# EAGLE design lisa_l_low_carrier (EAGLE 6.1)
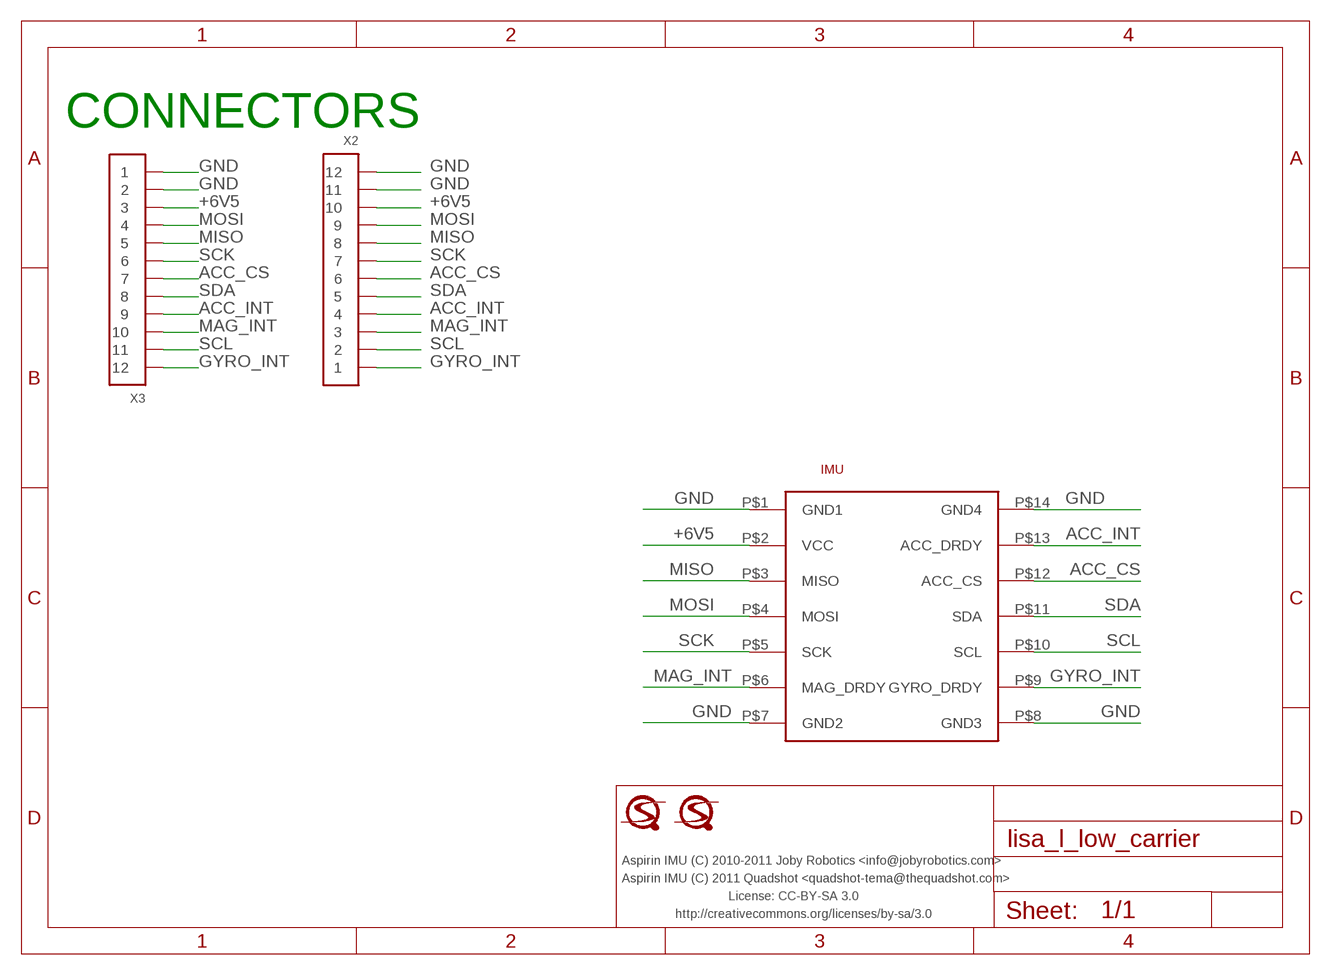
[diagram p0: schematic, sheet 1]

## Parts
IMU  ASPIRIN  [ASPIRIN_1]
U$1  LOGO  [LOGO]
U$2  LOGO  [LOGO]
X2  CONN_12-1-53261  [PB-53261-12]
X3  CONN_12-1-53047  [PB-53047-12]

## Nets
+6V5: IMU.P$2(VCC) X2.10 X3.3
ACC_CS: IMU.P$12(ACC_CS) X2.6 X3.7
ACC_INT: IMU.P$13(ACC_DRDY) X2.4 X3.9
GND: IMU.P$1(GND1) IMU.P$7(GND2) IMU.P$8(GND3) IMU.P$14(GND4) X2.11 X2.12 X3.1 X3.2
GYRO_INT: IMU.P$9(GYRO_DRDY) X2.1 X3.12
MAG_INT: IMU.P$6(MAG_DRDY) X2.3 X3.10
MISO: IMU.P$3(MISO) X2.8 X3.5
MOSI: IMU.P$4(MOSI) X2.9 X3.4
SCK: IMU.P$5(SCK) X2.7 X3.6
SCL: IMU.P$10(SCL) X2.2 X3.11
SDA: IMU.P$11(SDA) X2.5 X3.8

## Notes on the sheet
- CONNECTORS
- Aspirin IMU (C) 2010-2011 Joby Robotics <info@jobyrobotics.com>
- Aspirin IMU (C) 2011 Quadshot <quadshot-tema@thequadshot.com>
- License: CC-BY-SA 3.0
- http://creativecommons.org/licenses/by-sa/3.0

## Library data of the parts
IMU = joby_robotics:ASPIRIN
U$1 U$2 = quadshot:LOGO
X2 X3 = pel_molex:CONN_12-1

## Board
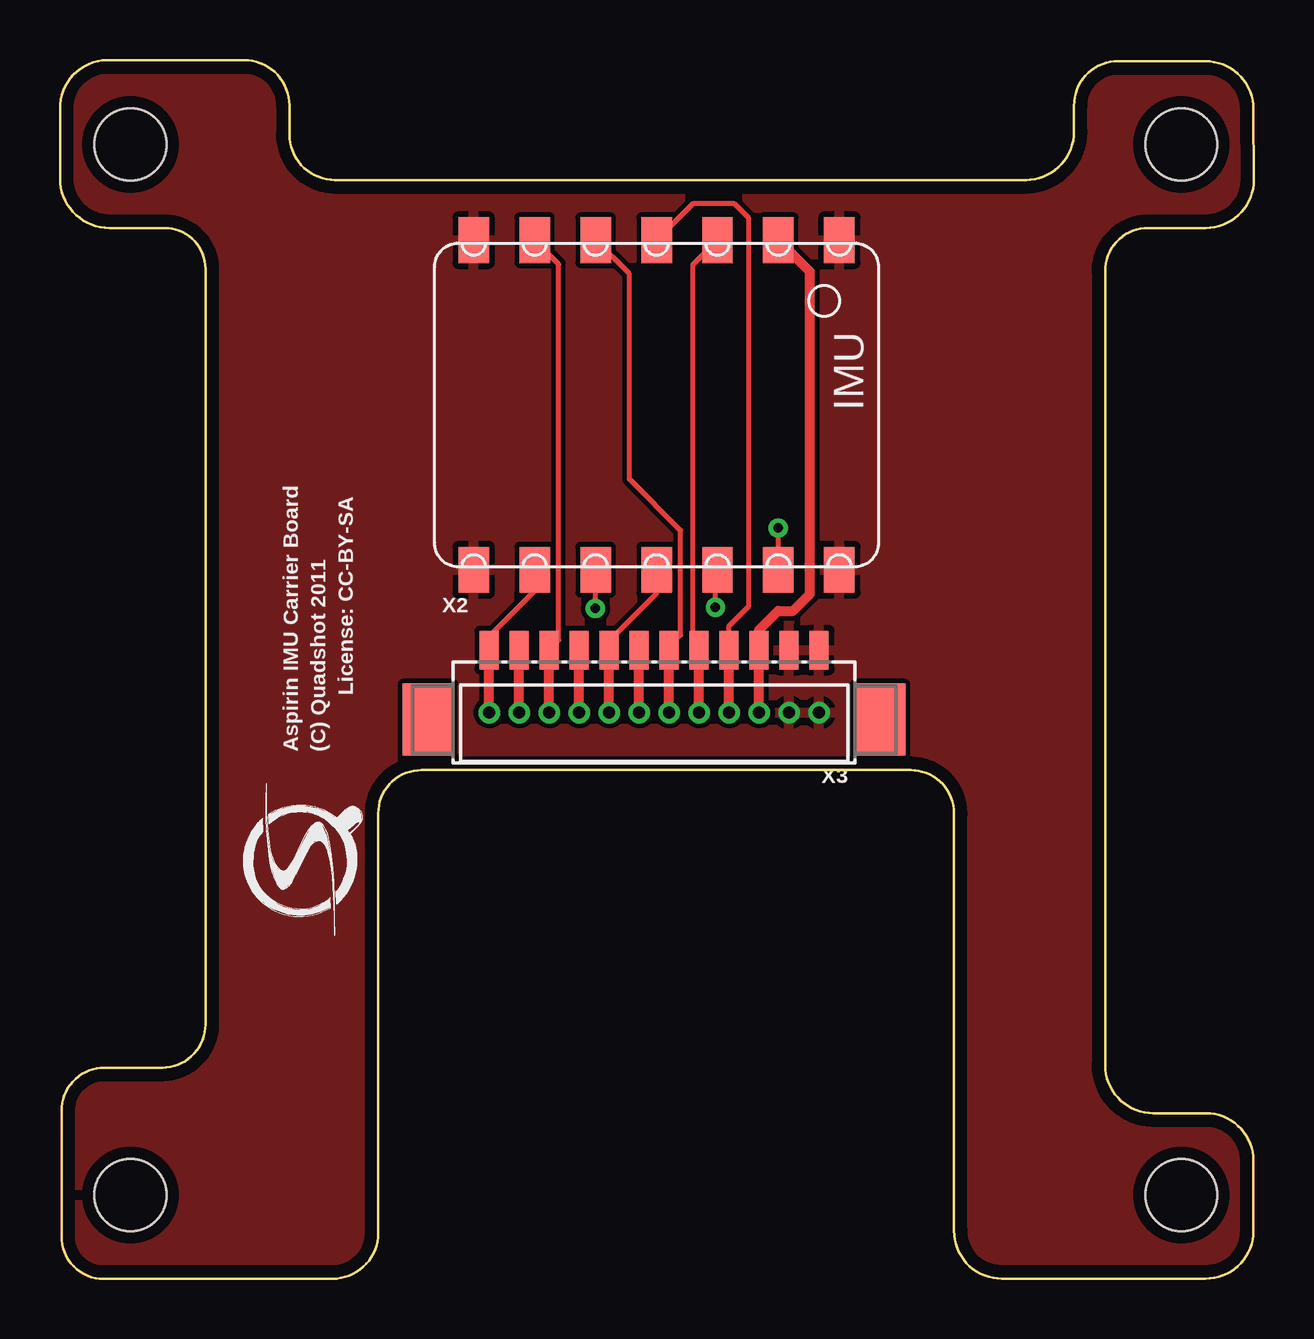
[diagram p1: board, top side]
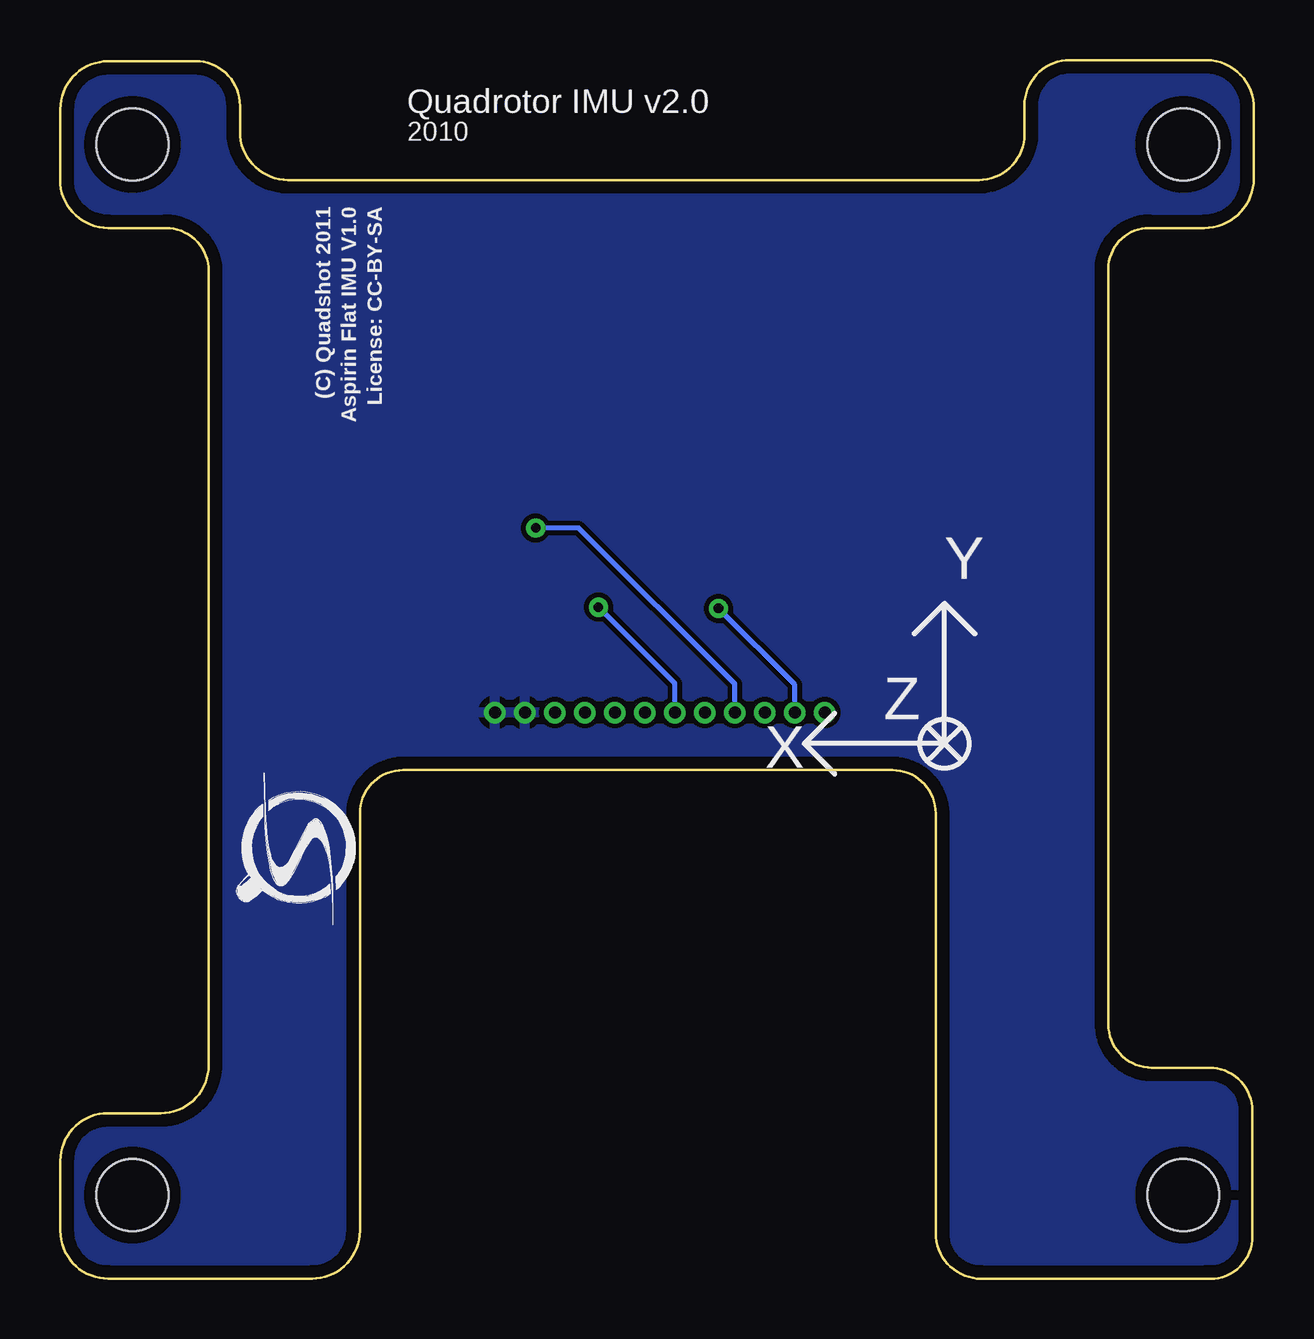
[diagram p2: board, bottom side, seen from below]

Size 49.76 x 50.81 mm. Coordinates in mm from the lower left corner, seen from the top.
Outline: 1.96,50.81 7.66,50.81 arc-90 9.56,48.91 9.56,47.71 arc90 11.46,45.81 40.26,45.81 arc90 42.26,47.81 42.26,48.91 arc-90 44.11,50.76 47.75,50.76 arc-90 49.75,48.76 49.76,45.81 arc-90 47.76,43.81 45.36,43.81 arc90 43.56,42.01 43.56,8.91 arc90 45.56,6.91 47.76,6.91 arc-90 49.75,4.92 49.75,2.01 arc-90 47.75,0.01 39.26,0.01 arc-90 37.26,2.01 37.26,19.41 arc90 35.46,21.21 15.06,21.21 arc90 13.26,19.41 13.26,1.91 arc-90 11.36,0.01 2,0.01 arc-90 0.06,1.61 0.06,7.01 arc-90 1.86,8.81 4.26,8.81 arc90 6.06,10.61 6.06,42.11 arc90 4.36,43.81 2.06,43.81 arc-90 0,45.87 0,48.76 arc-90 1.96,50.81
Copper layers (1*16): Top 0.035mm / dielectric 0.2mm / Bottom 0.035mm
Design rules: minimum track width 8mil, minimum drill 0.4mm, track to track 8mil, track to pad 8mil, pad to pad 8mil, via to via 8mil, smd to smd 8mil, copper to edge 20mil, drill to drill 8mil, minimum pad ring 0.2mm, minimum via ring 0.2mm, stop-mask expansion 4mil, vias tented up to drill 0.4mm, thermal gap 10mil
Holes 3 mm at 46.74,3.49 2.94,3.49 46.74,47.29 2.94,47.29

### Footprints (pad centres in the part's own frame; a part is rotated, then mirrored left to right if it is on the bottom)
ASPIRIN_1 = smd 1.905 x 1.27: P$1 -6.87,7.62; P$2 -6.87,5.08; P$3 -6.87,2.54; P$4 -6.87,0; P$5 -6.87,-2.54; P$6 -6.87,-5.08; P$7 -6.87,-7.62; P$8 6.87,-7.62; P$9 6.87,-5.08; P$10 6.87,-2.54; P$11 6.87,0; P$12 6.87,2.54; P$13 6.87,5.08; P$14 6.87,7.62
PB-53261-12 = smd 0.8 x 1.6: 1 -6.875,1.1; 2 -5.625,1.1; 3 -4.375,1.1; 4 -3.125,1.1; 5 -1.875,1.1; 6 -0.625,1.1; 7 0.625,1.1; 8 1.875,1.1; 9 3.125,1.1; 10 4.375,1.1; 11 5.625,1.1; 12 6.875,1.1 | smd 2.1 x 3: MNT1 -9.425,-1.8; MNT2 9.425,-1.8
PB-53047-12 = drill 0.5: 1 -6.875,0; 2 -5.625,0; 3 -4.375,0; 4 -3.125,0; 5 -1.875,0; 6 -0.625,0; 7 0.625,0; 8 1.875,0; 9 3.125,0; 10 4.375,0; 11 5.625,0; 12 6.875,0

### Placement (x,y rotation side)
IMU  24.87,36.43 270 top
U$1  39.76,17.91 270 bottom
U$2  9.96,17.51 90 top
X2  24.76,25.11 0 top
X3  24.76,23.61 180 top

### Tracks (layer width: path | path; a pad name or v marks a point on that pad's centre or on a via)
+6V5
  Top 0.406: X3.3 X2.10 29.14,27.05 29.93,27.85 30.54,27.85 31.25,28.56 31.25,41.99 IMU.P$2
ACC_CS  (via drill 0.4)
  Top 0.203: IMU.P$12 27.32,29.47 v27.32,28
  Top 0.406: X3.7 X2.6
  Bottom 0.203: v27.32,28 24.14,24.82 X3.7
ACC_INT  (via drill 0.4)
  Top 0.203: IMU.P$13 29.93,29.57 v29.93,31.3
  Top 0.406: X3.9 X2.4
  Bottom 0.203: v29.93,31.3 28.14,31.3 21.64,24.8 X3.9
GND
  pour Top (rank 6): 0,0.03 49.71,0.03 49.71,50.76 0,50.76
  pour Bottom: 0.08,50.76 49.71,50.76 49.71,0.08 0.08,0.08
GYRO_INT
  Top 0.203: IMU.P$9 19.79,28.67 17.89,26.77 X2.1
  Top 0.406: X3.12 X2.1
MAG_INT
  Top 0.203: IMU.P$6 20.79,42.29 20.79,26.63 20.39,26.23 X2.3
  Top 0.406: X3.10 X2.3
MISO
  Top 0.203: IMU.P$3 26.38,42.27 26.38,26.63 26.64,26.37 X2.8
  Top 0.406: X3.5 X2.8
MOSI
  Top 0.203: 27.89,26.31 X2.9 27.89,27.22 28.71,28.05 28.71,44.2 28.11,44.81 26.38,44.81 IMU.P$4
  Top 0.406: X3.4 X2.9
SCK
  Top 0.203: X2.7 25.39,26.35 25.87,26.83 25.87,31.2 23.74,33.33 23.74,41.89 23.73,41.89 IMU.P$5
  Top 0.406: X3.6 X2.7
SCL  (via drill 0.4)
  Top 0.203: IMU.P$10 22.33,27.96 v22.31,27.95
  Top 0.406: X3.11 X2.2
  Bottom 0.203: v22.31,27.95 19.14,24.77 X3.11
SDA
  Top 0.203: IMU.P$11 24.87,28.57 22.89,26.59 X2.5
  Top 0.406: X3.8 X2.5

### Text on the board
tPlace: License: CC-BY-SA | Aspirin IMU Carrier Board | (C) Quadshot 2011
bPlace: License: CC-BY-SA | Aspirin Flat IMU V1.0 | (C) Quadshot 2011
bNames: Quadrotor IMU v2.0 | 2010 | Y | Z | X